# EAGLE schematic BlinkyBall (EAGLE 6.2)
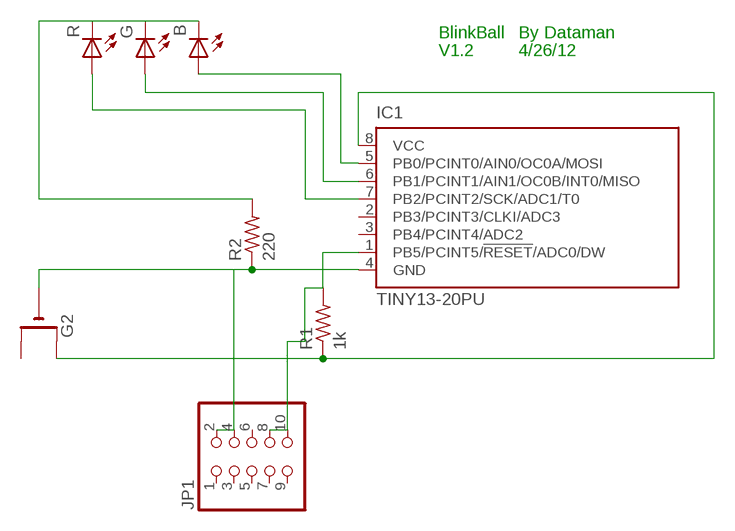
[diagram p0: schematic, sheet 1]

## Parts
B  LED5MM  [LED5MM]
G  LED5MM  [LED5MM]
G2  CR1220SMT  [CR1220-SMD]
IC1  TINY13-20PU  [DIL08]
JP1  PINHD-2X5  [2X05]
R  LED5MM  [LED5MM]
R1  1k  R-US_0309/12  [0309/12]
R2  220  R-US_0309/12  [0309/12]

## Nets
N$1: IC1.1(PB5/PCINT5/!RESET!/ADC0/DW) JP1.8 JP1.10 R1.2
N$2: B.K(C) G.K(C) R2.2 R.K(C)
N$3: B.A IC1.5(PB0/PCINT0/AIN0/OC0A/MOSI)
N$4: G.A IC1.6(PB1/PCINT1/AIN1/OC0B/INT0/MISO)
N$5: G2.+$1(+) IC1.8(VCC) R1.1
N$6: IC1.7(PB2/PCINT2/SCK/ADC1/T0) R.A
N$8: G2.- IC1.4(GND) JP1.2 R2.1
Unconnected: G2.+$2(+1) IC1.2(PB3/PCINT3/CLKI/ADC3) IC1.3(PB4/PCINT4/ADC2) JP1.1 JP1.3 JP1.4 JP1.5 JP1.6 JP1.7 JP1.9

## Notes on the sheet
- BlinkBall | By Dataman
- V1.2 | 4/26/12

## Library data of the parts
B G R = adafruit:LED: LED OSRAM: - CHIPLED LG R971, LG N971, LY N971, LG Q971, LY Q971, LO R971, LY R971 LH N974, LH R974 LS Q976, LO Q976, LY Q976 LO Q996 - Hyper CHIPLED LW Q18S LB Q993, LB Q99A, LB R99A - SideLED LS A670, LO A670, LY A670, LG A670, LP A670 LB A673, LV A673, LT A673, LW A673 LH A674 LY A675 LS A676, LA A676, LO A676, LY A676, LW A676 LS A679, LY A679, LG A679 - Hyper Micro SIDELED® LS Y876, LA Y876, LO Y876, LY Y876 LT Y87S - SmartLED LW L88C, LW L88S LB L89C, LB L89S, LG L890 LS L89K, LO L89K, LY L89K LS L896, LA L896, LO L896, LY L896 - TOPLED LS T670, LO T670, LY T670, LG T670, LP T670 LSG T670, LSP T670, LSY T670, LOP T670, LYG T670 LG T671, LOG T671, LSG T671 LB T673, LV T673, LT T673, LW T673 LH T674 LS T676, LA T676, LO T676, LY T676, LB T676, LH T676, LSB T676, LW T676 LB T67C, LV T67C, LT T67C, LS T67K, LO T67K, LY T67K, LW E67C LS E67B, LA E67B, LO E67B, LY E67B, LB E67C, LV E67C, LT E67C LW T67C LS T679, LY T679, LG T679 LS T770, LO T770, LY T770, LG T770, LP T770 LB T773, LV T773, LT T773, LW T773 LH T774 LS E675, LA E675, LY E675, LS T675 LS T776, LA T776, LO T776, LY T776, LB T776 LHGB T686 LT T68C, LB T68C - Hyper Mini TOPLED® LB M676 - Mini TOPLED Santana® LG M470 LS M47K, LO M47K, LY M47K Source: http://www.osram.convergy.de/
G2 = adafruit:CR1220: CR1216/CR1220/CR1225 12mm 3V lithium coin cell Great for battery packup. Both SMT and THM holders. Note the THM package has the ground pads on both sides of the PCB so that the masks are the same - this reduces the cost
IC1 = atmel:TINY13: 8-bit AVR Microcontroller with 1K Bytes In-System Programmable Flash Source: http://www.atmel.com/dyn/resources/prod_documents/2535S.pdf; MPN: ATTINY13-20PU; OC_FARNELL: 9171550; OC_NEWARK: 96K6521
JP1 = pinhead:PINHD-2X5: PIN HEADER
R1 R2 = resistor:R-US_: RESISTOR, American symbol